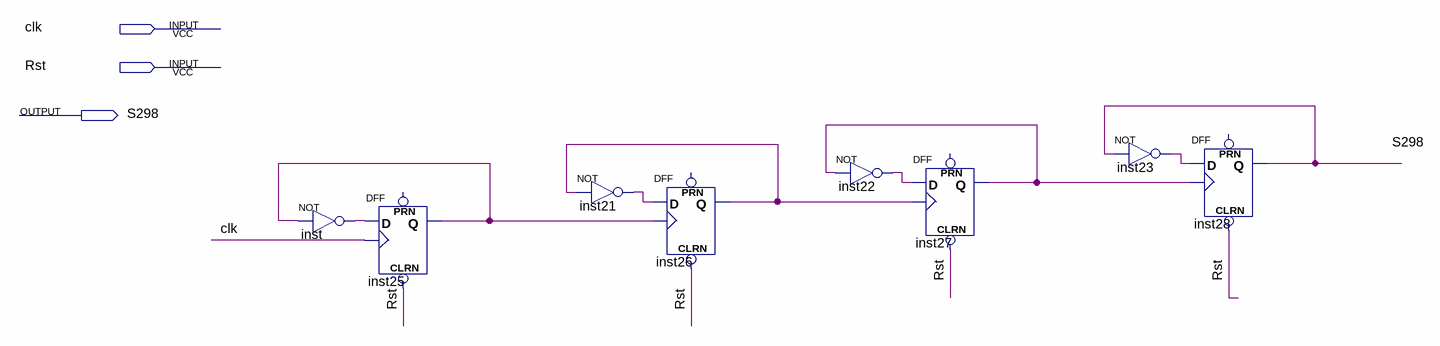
[diagram p0: schematic sheet]
// Quartus schematic lab07.bdf as structural Verilog: 8 symbols, 3 pins
module lab07 (
  input  clk,
  input  Rst,
  output S298
);

  wire inst21_out, inst22_out, inst23_out, inst25_q, inst26_q, inst27_q, inst_out;

  not inst (inst_out, inst25_q);
  DFF inst25 (.CLRN(Rst), .CLK(clk), .D(inst_out), .Q(inst25_q));  // open: PRN
  not inst21 (inst21_out, inst26_q);
  DFF inst26 (.CLRN(Rst), .CLK(inst25_q), .D(inst21_out), .Q(inst26_q));  // open: PRN
  not inst22 (inst22_out, inst27_q);
  DFF inst27 (.CLRN(Rst), .CLK(inst26_q), .D(inst22_out), .Q(inst27_q));  // open: PRN
  not inst23 (inst23_out, S298);
  DFF inst28 (.CLRN(Rst), .CLK(inst27_q), .D(inst23_out), .Q(S298));  // open: PRN
endmodule
